# Altium project ina_board_2.PrjPcb
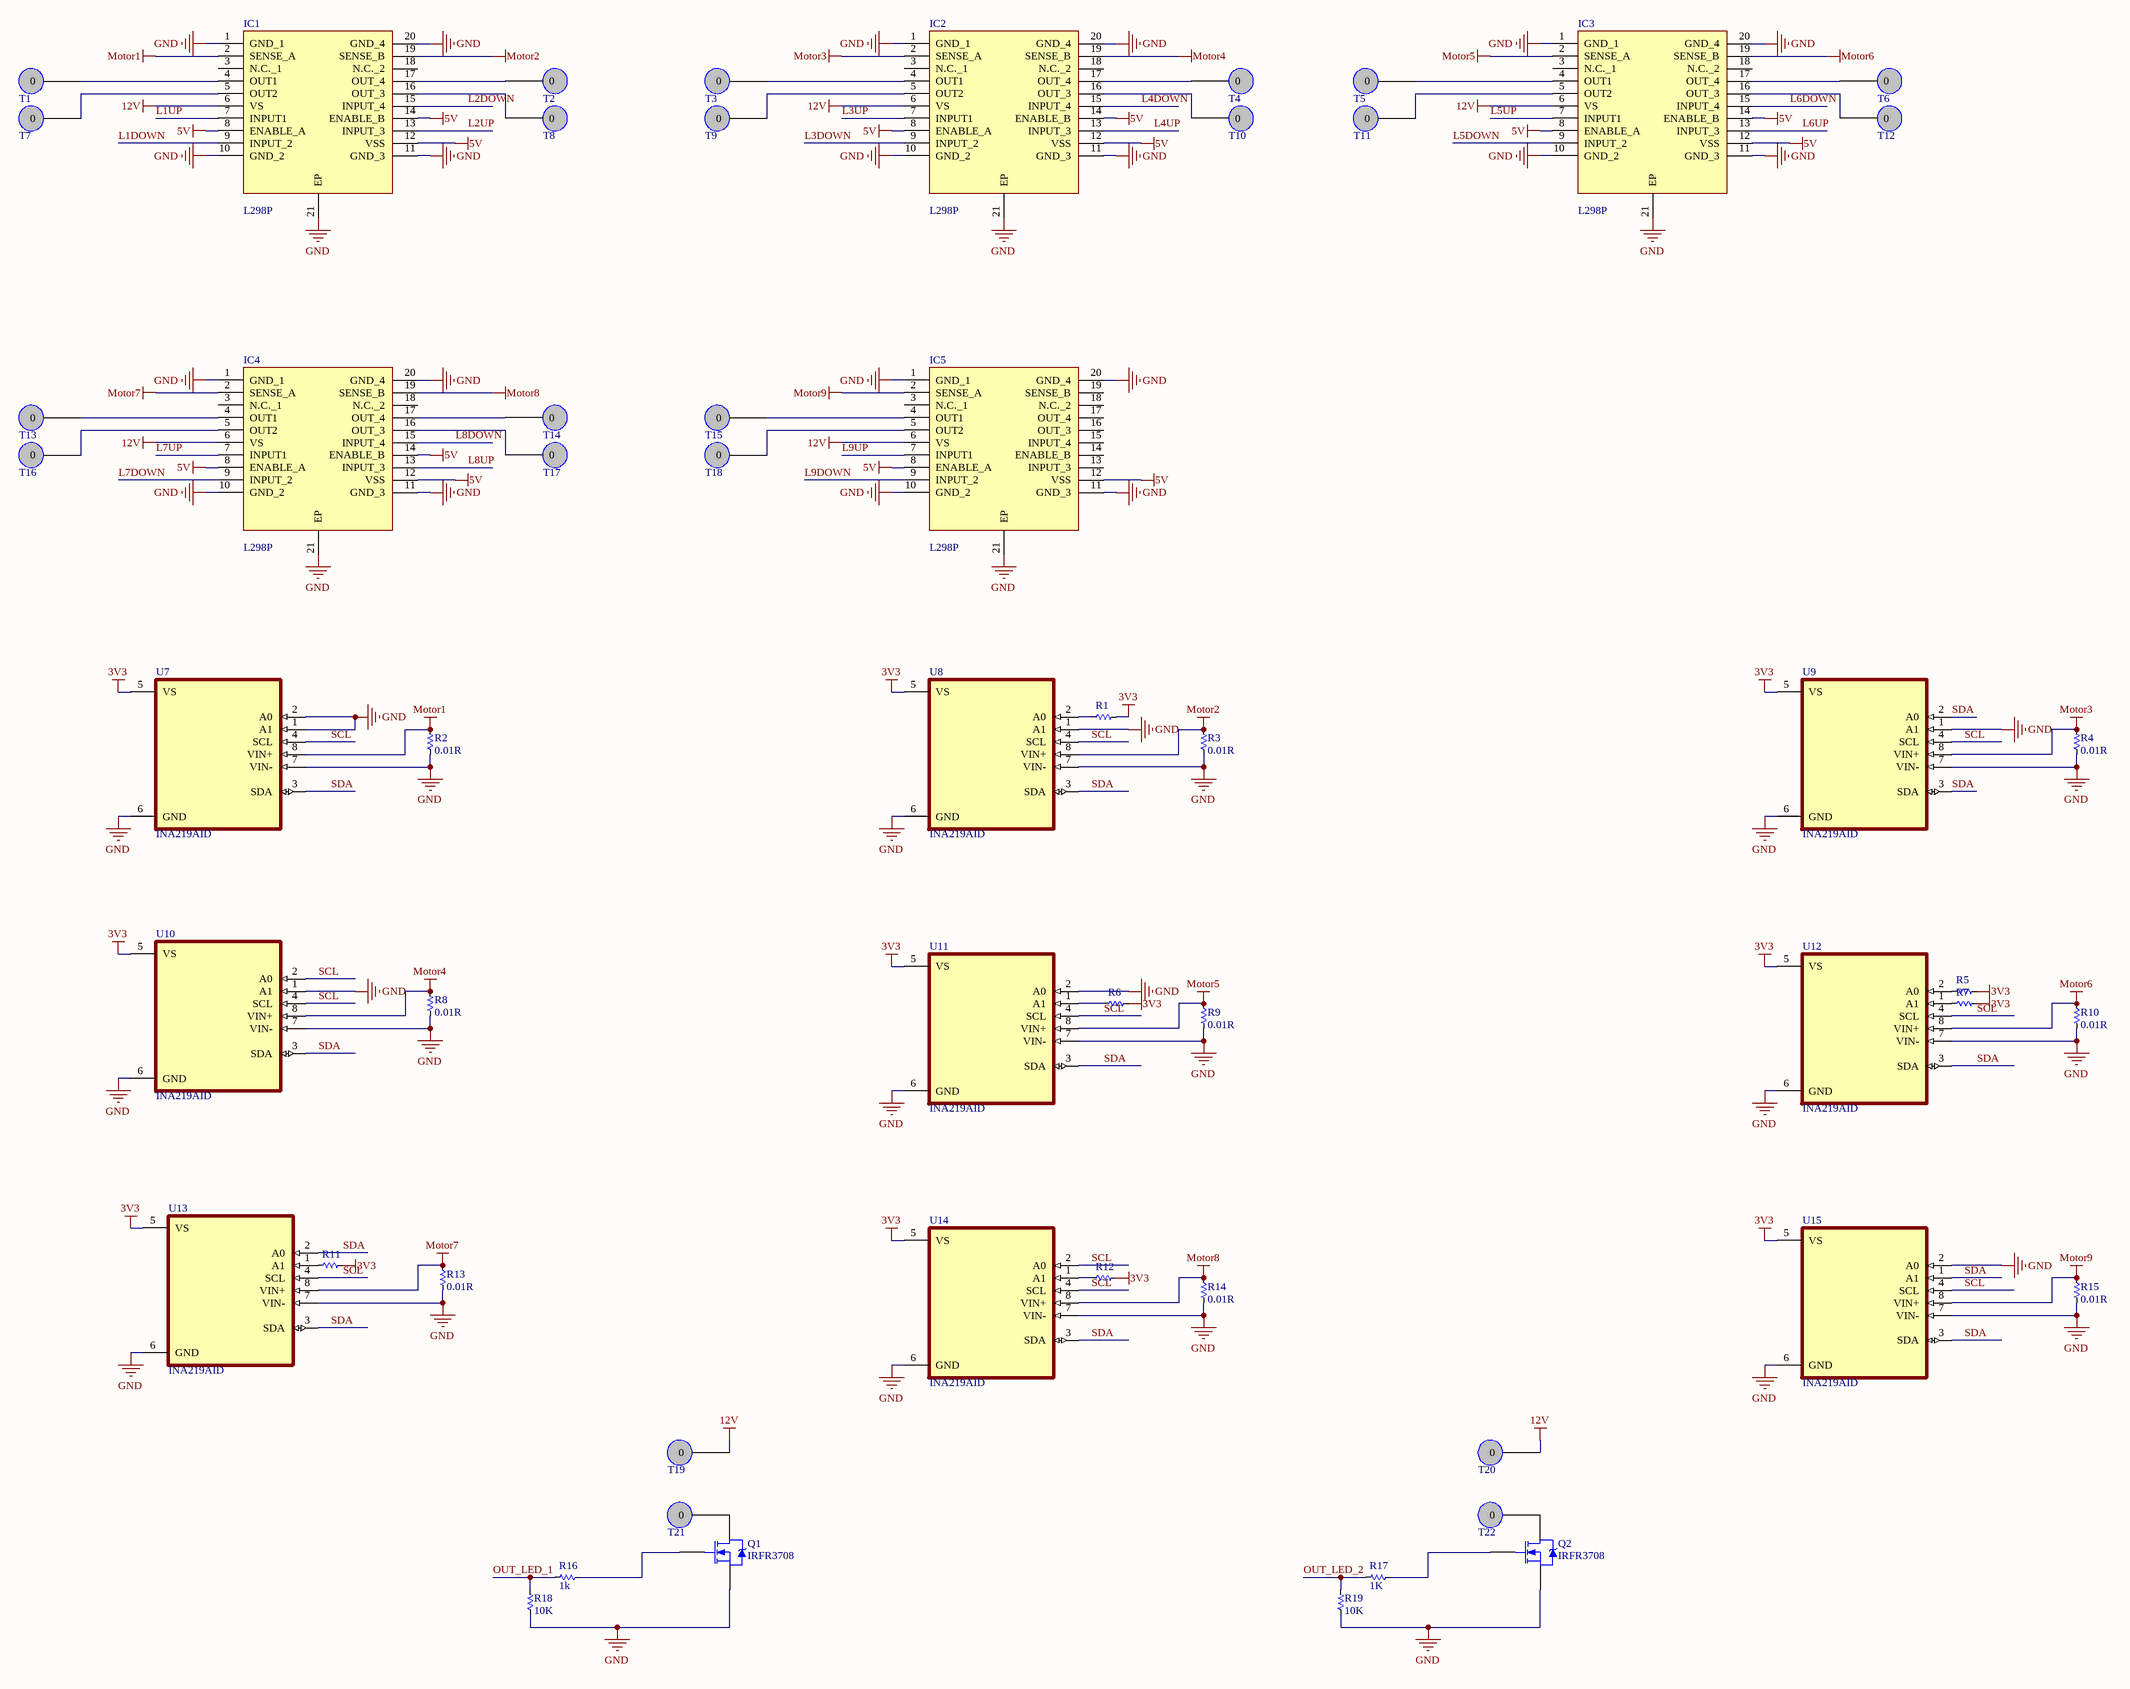
[diagram p0: ina219.SchDoc]
4 sheets, 158 parts. Net scope: global (net labels, ports and power ports of the same name join across sheets).
Board file: board_2.PcbDoc
Sheets:
  ina219.SchDoc
  user.SchDoc
  74hc595.SchDoc
  servo.SchDoc

## Sheet ina219.SchDoc
size A2

### Parts
IC1  L298P  [SOIC127P1420X360-21N]
IC2  L298P  [SOIC127P1420X360-21N]
IC3  L298P  [SOIC127P1420X360-21N]
IC4  L298P  [SOIC127P1420X360-21N]
IC5  L298P  [SOIC127P1420X360-21N]
Q1  IRFR3708  [TO-252AA_M]
Q2  IRFR3708  [TO-252AA_M]
R1  Res  [RES-SMD-0603]  (value not drawn)
R2  0.01R  [RES-SMD-2512]
R3  0.01R  [RES-SMD-2512]
R4  0.01R  [RES-SMD-2512]
R5  Res  [RES-SMD-0603]  (value not drawn)
R6  Res  [RES-SMD-0603]  (value not drawn)
R7  Res  [RES-SMD-0603]  (value not drawn)
R8  0.01R  [RES-SMD-2512]
R9  0.01R  [RES-SMD-2512]
R10  0.01R  [RES-SMD-2512]
R11  Res  [RES-SMD-0603]  (value not drawn)
R12  Res  [RES-SMD-0603]  (value not drawn)
R13  0.01R  [RES-SMD-2512]
R14  0.01R  [RES-SMD-2512]
R15  0.01R  [RES-SMD-2512]
R16  1k  [RES-SMD-0603]
R17  1K  [RES-SMD-0603]
R18  10K  [RES-SMD-0603]
R19  10K  [RES-SMD-0603]
T1  Pad  [PCBComponent_1]  (value not drawn)
T2  Pad  [PCBComponent_1]  (value not drawn)
T3  Pad  [PCBComponent_1]  (value not drawn)
T4  Pad  [PCBComponent_1]  (value not drawn)
T5  Pad  [PCBComponent_1]  (value not drawn)
T6  Pad  [PCBComponent_1]  (value not drawn)
T7  Pad  [PCBComponent_1]  (value not drawn)
T8  Pad  [PCBComponent_1]  (value not drawn)
T9  Pad  [PCBComponent_1]  (value not drawn)
T10  Pad  [PCBComponent_1]  (value not drawn)
T11  Pad  [PCBComponent_1]  (value not drawn)
T12  Pad  [PCBComponent_1]  (value not drawn)
T13  Pad  [PCBComponent_1]  (value not drawn)
T14  Pad  [PCBComponent_1]  (value not drawn)
T15  Pad  [PCBComponent_1]  (value not drawn)
T16  Pad  [PCBComponent_1]  (value not drawn)
T17  Pad  [PCBComponent_1]  (value not drawn)
T18  Pad  [PCBComponent_1]  (value not drawn)
T19  Pad  [PCBComponent_1]  (value not drawn)
T20  Pad  [PCBComponent_1]  (value not drawn)
T21  Pad  [PCBComponent_1]  (value not drawn)
T22  Pad  [PCBComponent_1]  (value not drawn)
U7  INA219AID  [SOIC127P599X175-8N]
U8  INA219AID  [SOIC127P599X175-8N]
U9  INA219AID  [SOIC127P599X175-8N]
U10  INA219AID  [SOIC127P599X175-8N]
U11  INA219AID  [SOIC127P599X175-8N]
U12  INA219AID  [SOIC127P599X175-8N]
U13  INA219AID  [SOIC127P599X175-8N]
U14  INA219AID  [SOIC127P599X175-8N]
U15  INA219AID  [SOIC127P599X175-8N]

### Nets
3V3: R1.1 R5.1 R6.1 R7.1 R11.1 R12.1 U7.5(VS) U8.5(VS) U9.5(VS) U10.5(VS) U11.5(VS) U12.5(VS) U13.5(VS) U14.5(VS) U15.5(VS)
5V: IC1.8(ENABLE_A) IC1.12(VSS) IC1.14(ENABLE_B) IC2.8(ENABLE_A) IC2.12(VSS) IC2.14(ENABLE_B) IC3.8(ENABLE_A) IC3.12(VSS) IC3.14(ENABLE_B) IC4.8(ENABLE_A) IC4.12(VSS) IC4.14(ENABLE_B) IC5.8(ENABLE_A) IC5.12(VSS)
12V: IC1.6(VS) IC2.6(VS) IC3.6(VS) IC4.6(VS) IC5.6(VS) T19.0 T20.0
GND: IC1.1(GND_1) IC1.10(GND_2) IC1.11(GND_3) IC1.20(GND_4) IC1.21(EP) IC2.1(GND_1) IC2.10(GND_2) IC2.11(GND_3) IC2.20(GND_4) IC2.21(EP) IC3.1(GND_1) IC3.10(GND_2) IC3.11(GND_3) IC3.20(GND_4) IC3.21(EP) IC4.1(GND_1) IC4.10(GND_2) IC4.11(GND_3) IC4.20(GND_4) IC4.21(EP) IC5.1(GND_1) IC5.10(GND_2) IC5.11(GND_3) IC5.20(GND_4) IC5.21(EP) Q1.3(S) Q2.3(S) R2.2 R3.2 R4.2 R8.2 R9.2 R10.2 R13.2 R14.2 R15.2 R18.2 R19.2 U7.1(A1) U7.2(A0) U7.6(GND) U7.7(VIN-) U8.1(A1) U8.6(GND) U8.7(VIN-) U9.1(A1) U9.6(GND) U9.7(VIN-) U10.1(A1) U10.6(GND) U10.7(VIN-) U11.2(A0) U11.6(GND) U11.7(VIN-) U12.6(GND) U12.7(VIN-) U13.6(GND) U13.7(VIN-) U14.6(GND) U14.7(VIN-) U15.2(A0) U15.6(GND) U15.7(VIN-)
Motor1: IC1.2(SENSE_A) R2.1 U7.8(VIN+)
Motor2: IC1.19(SENSE_B) R3.1 U8.8(VIN+)
Motor3: IC2.2(SENSE_A) R4.1 U9.8(VIN+)
Motor4: IC2.19(SENSE_B) R8.1 U10.8(VIN+)
Motor5: IC3.2(SENSE_A) R9.1 U11.8(VIN+)
Motor6: IC3.19(SENSE_B) R10.1 U12.8(VIN+)
Motor7: IC4.2(SENSE_A) R13.1 U13.8(VIN+)
Motor8: IC4.19(SENSE_B) R14.1 U14.8(VIN+)
Motor9: IC5.2(SENSE_A) R15.1 U15.8(VIN+)
L1DOWN: IC1.9(INPUT_2)
L1UP: IC1.7(INPUT1)
L2DOWN: IC1.15(INPUT_4)
L2UP: IC1.13(INPUT_3)
L3DOWN: IC2.9(INPUT_2)
L3UP: IC2.7(INPUT1)
L4DOWN: IC2.15(INPUT_4)
L4UP: IC2.13(INPUT_3)
L5DOWN: IC3.9(INPUT_2)
L5UP: IC3.7(INPUT1)
L6DOWN: IC3.15(INPUT_4)
L6UP: IC3.13(INPUT_3)
L7DOWN: IC4.9(INPUT_2)
L7UP: IC4.7(INPUT1)
L8DOWN: IC4.15(INPUT_4)
L8UP: IC4.13(INPUT_3)
L9DOWN: IC5.9(INPUT_2)
L9UP: IC5.7(INPUT1)
OUT_LED_1: R16.1 R18.1
OUT_LED_2: R17.1 R19.1
SCL: U7.4(SCL) U8.4(SCL) U9.4(SCL) U10.2(A0) U10.4(SCL) U11.4(SCL) U12.4(SCL) U13.4(SCL) U14.2(A0) U14.4(SCL) U15.4(SCL)
SDA: U7.3(SDA) U8.3(SDA) U9.2(A0) U9.3(SDA) U10.3(SDA) U11.3(SDA) U12.3(SDA) U13.2(A0) U13.3(SDA) U14.3(SDA) U15.1(A1) U15.3(SDA)
NetIC1_4: IC1.4(OUT1) T1.0
NetIC1_5: IC1.5(OUT2) T7.0
NetIC1_16: IC1.16(OUT_3) T8.0
NetIC1_17: IC1.17(OUT_4) T2.0
NetIC2_4: IC2.4(OUT1) T3.0
NetIC2_5: IC2.5(OUT2) T9.0
NetIC2_16: IC2.16(OUT_3) T10.0
NetIC2_17: IC2.17(OUT_4) T4.0
NetIC3_4: IC3.4(OUT1) T5.0
NetIC3_5: IC3.5(OUT2) T11.0
NetIC3_16: IC3.16(OUT_3) T12.0
NetIC3_17: IC3.17(OUT_4) T6.0
NetIC4_4: IC4.4(OUT1) T13.0
NetIC4_5: IC4.5(OUT2) T16.0
NetIC4_16: IC4.16(OUT_3) T17.0
NetIC4_17: IC4.17(OUT_4) T14.0
NetIC5_4: IC5.4(OUT1) T15.0
NetIC5_5: IC5.5(OUT2) T18.0
NetQ1_1: Q1.1(G) R16.2
NetQ1_4: Q1.4(D) T21.0
NetQ2_1: Q2.1(G) R17.2
NetQ2_4: Q2.4(D) T22.0
NetR1_2: R1.2 U8.2(A0)
NetR5_2: R5.2 U12.2(A0)
NetR6_2: R6.2 U11.1(A1)
NetR7_2: R7.2 U12.1(A1)
NetR11_2: R11.2 U13.1(A1)
NetR12_2: R12.2 U14.1(A1)

Not connected (* = marked no-connect by the designer): IC1 3(N.C._1) 18(N.C._2); IC2 3(N.C._1) 18(N.C._2); IC3 3(N.C._1) 18(N.C._2); IC4 3(N.C._1) 18(N.C._2); IC5 3(N.C._1) 13(INPUT_3) 14(ENABLE_B) 15(INPUT_4) 16(OUT_3) 17(OUT_4) 18(N.C._2) 19(SENSE_B)

### Library data of the parts
IC1-IC5 = L298P: Integrated Circuit; Manufacturer_Name: STMicroelectronics; Datasheet Link: https://datasheet.datasheetarchive.com/originals/distributors/Datasheets-32/DSA-634400.pdf; Height: 3.6mm; Manufacturer_Part_Number: L298P; Mouser Part Number: 511-L298P; Mouser Price/Stock: https://www.mouser.co.uk/ProductDetail/STMicroelectronics/L298P?qs=lDh9v96ogBZNJERYYNX11w%3D%3D; Arrow Part Number: L298P; Arrow Price/Stock: https://www.arrow.com/en/products/l298p/stmicroelectronics
Q1 Q2 = IRFR3910: HEXFET Power MOSFET; Note: Pin 2 is trimmed and is electrically connected to Drain.; Published: 8-Jun-2000; LatestRevisionDate: 20-Nov-2009; LatestRevisionNote: IPC-7351 Footprint Added.; DatasheetVersion: May-1998; PackageVersion: Feb-2003; PackageReference: TO-252AA; Publisher: Altium Limited; PackageDescription: 3-Pin HEXFET Package 2.28 mm Pitch, 9.9 mm Lead Span; Code_JEDEC: TO-252-AA; ComponentLink1Description: Manufacturer Link; ComponentLink1URL: http://www.irf.com/; ComponentLink2Description: Datasheet; ComponentLink2URL: http://www.irf.com/product-info/datasheets/data/irfr3910.pdf
R1-R19 = Res-SMD: Resistor; Manufacturer: Generic Components; Class: Passive; Published: 08/06/2000; Publisher: Altium Hobart Technology Centre
T1-T22 = Component_1
U7-U15 = INA219AID: 26V, 12-bit, i2c output current/voltage/power monitor 8-SOIC -40 to 125; MF: Texas Instruments; Purchase-URL: https://pricing.snapeda.com/search/part/INA219AID/?ref=eda; Package: SOIC-8 Texas Instruments; SnapEDA_Link: https://www.snapeda.com/parts/INA219AID/Texas%20Instruments/view-part/522322/?ref=snap; Value: *; Price: None; MP: INA219AID; Availability: Warning; Check_prices: https://www.snapeda.com/parts/INA219AID/Texas%20Instruments/view-part/522322/?ref=eda

## Sheet user.SchDoc
size A3
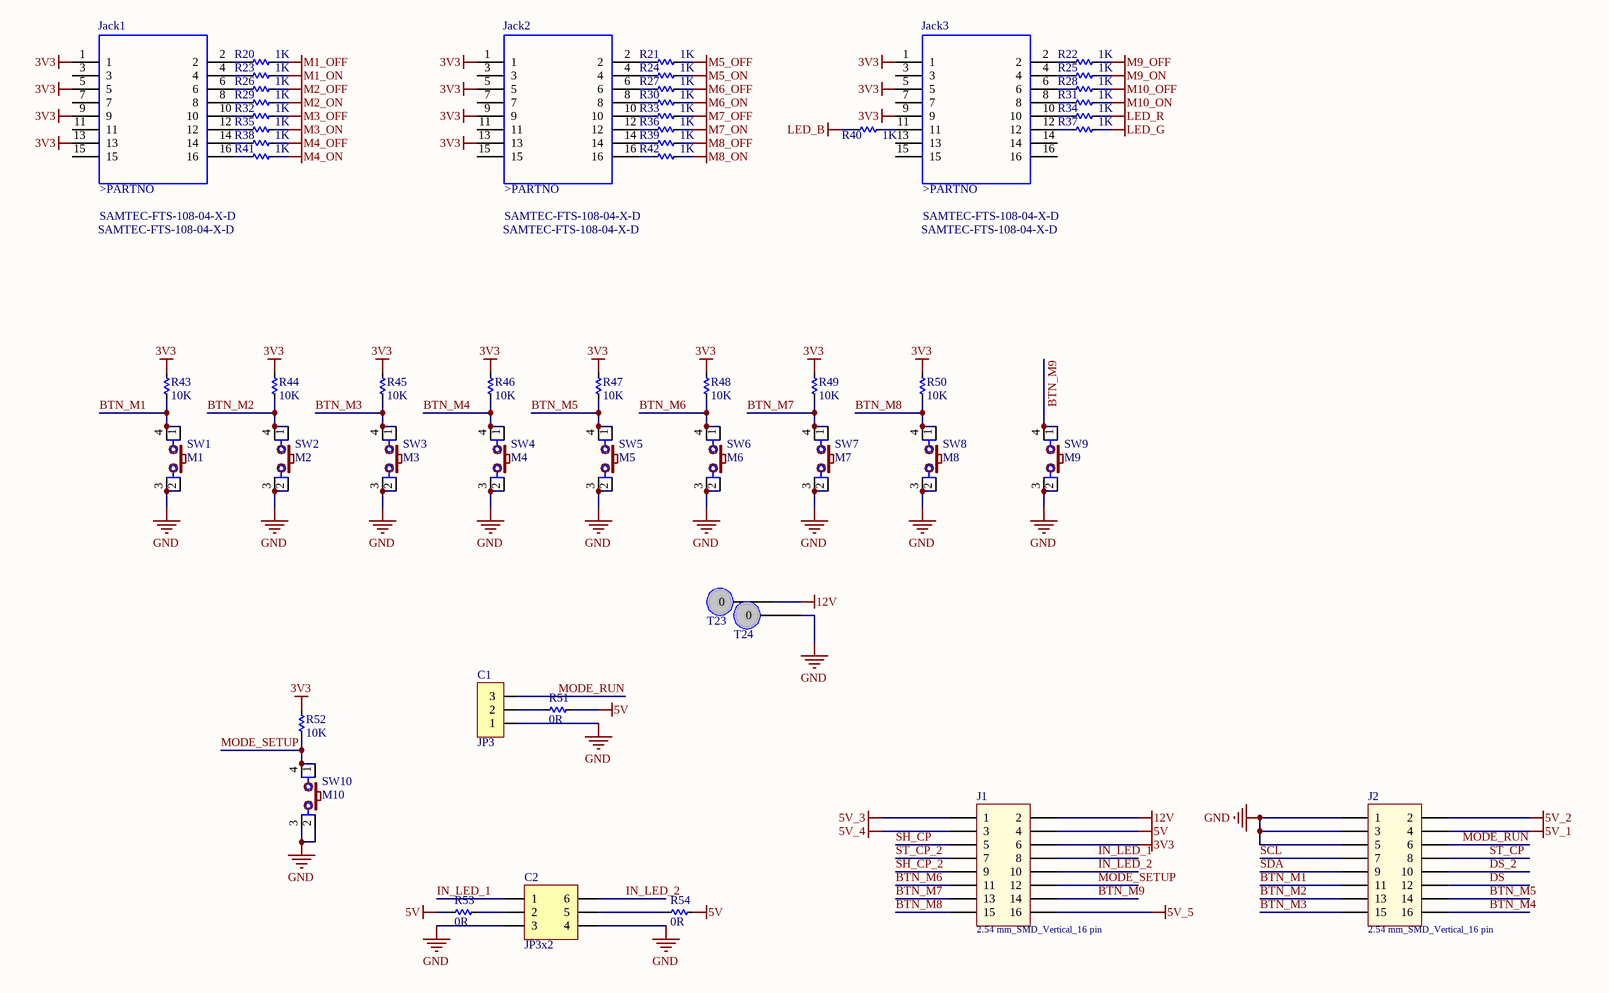
[diagram p1: user.SchDoc]

### Parts
C1  JP3  [JP3-D1C]
C2  JP3x2  [JP3-D2C]
J1  2.54 mm_SMD_Vertical_16 pin  [61031621121]
J2  2.54 mm_SMD_Vertical_16 pin  [61031621121]
Jack1  SAMTEC-FTS-108-04-X-D  [SAMTEC-FTS-108-04-X-D]
Jack2  SAMTEC-FTS-108-04-X-D  [SAMTEC-FTS-108-04-X-D]
Jack3  SAMTEC-FTS-108-04-X-D  [SAMTEC-FTS-108-04-X-D]
R20  1K  [RES-SMD-0603]
R21  1K  [RES-SMD-0603]
R22  1K  [RES-SMD-0603]
R23  1K  [RES-SMD-0603]
R24  1K  [RES-SMD-0603]
R25  1K  [RES-SMD-0603]
R26  1K  [RES-SMD-0603]
R27  1K  [RES-SMD-0603]
R28  1K  [RES-SMD-0603]
R29  1K  [RES-SMD-0603]
R30  1K  [RES-SMD-0603]
R31  1K  [RES-SMD-0603]
R32  1K  [RES-SMD-0603]
R33  1K  [RES-SMD-0603]
R34  1K  [RES-SMD-0603]
R35  1K  [RES-SMD-0603]
R36  1K  [RES-SMD-0603]
R37  1K  [RES-SMD-0603]
R38  1K  [RES-SMD-0603]
R39  1K  [RES-SMD-0603]
R40  1K  [RES-SMD-0603]
R41  1K  [RES-SMD-0603]
R42  1K  [RES-SMD-0603]
R43  10K  [RES-SMD-0603]
R44  10K  [RES-SMD-0603]
R45  10K  [RES-SMD-0603]
R46  10K  [RES-SMD-0603]
R47  10K  [RES-SMD-0603]
R48  10K  [RES-SMD-0603]
R49  10K  [RES-SMD-0603]
R50  10K  [RES-SMD-0603]
R51  0R  [RES-SMD-0603]
R52  10K  [RES-SMD-0603]
R53  0R  [RES-SMD-0603]
R54  0R  [RES-SMD-0603]
SW1  M1  [SW2-SMD]
SW2  M2  [SW2-SMD]
SW3  M3  [SW2-SMD]
SW4  M4  [SW2-SMD]
SW5  M5  [SW2-SMD]
SW6  M6  [SW2-SMD]
SW7  M7  [SW2-SMD]
SW8  M8  [SW2-SMD]
SW9  M9  [SW2-SMD]
SW10  M10  [SW2-SMD]
T23  Pad  [PCBComponent_1]  (value not drawn)
T24  Pad  [PCBComponent_1]  (value not drawn)

### Nets
3V3: J1.6 Jack1.1 Jack1.5 Jack1.9 Jack1.13 Jack2.1 Jack2.5 Jack2.9 Jack2.13 Jack3.1 Jack3.5 Jack3.9 R43.1 R44.1 R45.1 R46.1 R47.1 R48.1 R49.1 R50.1 R52.1
5V: J1.4 R51.1 R53.2 R54.1
5V_1: J2.4
5V_2: J2.2
5V_3: J1.1
5V_4: J1.3
5V_5: J1.16
12V: J1.2 T23.0
GND: C1.1 C2.3 C2.4 J2.1 J2.3 J2.5 SW1.2 SW1.3 SW2.2 SW2.3 SW3.2 SW3.3 SW4.2 SW4.3 SW5.2 SW5.3 SW6.2 SW6.3 SW7.2 SW7.3 SW8.2 SW8.3 SW9.2 SW9.3 SW10.2 SW10.3 T24.0
LED_B: R40.2
LED_G: R37.2
LED_R: R34.2
M1_OFF: R20.2
M1_ON: R23.2
M2_OFF: R26.2
M2_ON: R29.2
M3_OFF: R32.2
M3_ON: R35.2
M4_OFF: R38.2
M4_ON: R41.2
M5_OFF: R21.2
M5_ON: R24.2
M6_OFF: R27.2
M6_ON: R30.2
M7_OFF: R33.2
M7_ON: R36.2
M8_OFF: R39.2
M8_ON: R42.2
M9_OFF: R22.2
M9_ON: R25.2
M10_OFF: R28.2
M10_ON: R31.2
BTN_M1: J2.11 R43.2 SW1.1 SW1.4
BTN_M2: J2.13 R44.2 SW2.1 SW2.4
BTN_M3: J2.15 R45.2 SW3.1 SW3.4
BTN_M4: J2.16 R46.2 SW4.1 SW4.4
BTN_M5: J2.14 R47.2 SW5.1 SW5.4
BTN_M6: J1.11 R48.2 SW6.1 SW6.4
BTN_M7: J1.13 R49.2 SW7.1 SW7.4
BTN_M8: J1.15 R50.2 SW8.1 SW8.4
BTN_M9: J1.14 SW9.1 SW9.4
DS: J2.12
DS_2: J2.10
IN_LED_1: C2.1 J1.8
IN_LED_2: C2.6 J1.10
MODE_RUN: C1.3 J2.6
MODE_SETUP: J1.12 R52.2 SW10.1 SW10.4
SCL: J2.7
SDA: J2.9
SH_CP: J1.5
SH_CP_2: J1.9
ST_CP: J2.8
ST_CP_2: J1.7
NetC1_2: C1.2 R51.2
NetC2_2: C2.2 R53.1
NetC2_5: C2.5 R54.2
NetJack1_2: Jack1.2 R20.1
NetJack1_4: Jack1.4 R23.1
NetJack1_6: Jack1.6 R26.1
NetJack1_8: Jack1.8 R29.1
NetJack1_10: Jack1.10 R32.1
NetJack1_12: Jack1.12 R35.1
NetJack1_14: Jack1.14 R38.1
NetJack1_16: Jack1.16 R41.1
NetJack2_2: Jack2.2 R21.1
NetJack2_4: Jack2.4 R24.1
NetJack2_6: Jack2.6 R27.1
NetJack2_8: Jack2.8 R30.1
NetJack2_10: Jack2.10 R33.1
NetJack2_12: Jack2.12 R36.1
NetJack2_14: Jack2.14 R39.1
NetJack2_16: Jack2.16 R42.1
NetJack3_2: Jack3.2 R22.1
NetJack3_4: Jack3.4 R25.1
NetJack3_6: Jack3.6 R28.1
NetJack3_8: Jack3.8 R31.1
NetJack3_10: Jack3.10 R34.1
NetJack3_11: Jack3.11 R40.1
NetJack3_12: Jack3.12 R37.1

Not connected (* = marked no-connect by the designer): Jack1 3 7 11 15; Jack2 3 7 11 15; Jack3 3 7 13 14 15 16

### Notes on the sheet
- (in symbol SAMTEC-FTS-108-04-X-D) >PARTNO

### Library data of the parts
C1 = JP3: WR-PHD 2.54 mm Angled Socket Header; Manufacturer: W¨¹rth Elektronik eiSos GmbH; partNo: 613003143121; ComponentLink1 Description: Manufacturer; ComponentLink2 Description: Datasheet; NoPins: 03; Created Date: 29 March 2013; ComponentLink1URL: http://www.we-online.com; ComponentLink2URL: http://katalog.we-online.de/em/datasheet/6130xx143121.pdf; Created by: Karrer Zheng
C2 = JP3x2: WR-PHD 2.54 mm Dual Socket Header; Manufacturer: W¨¹rth Elektronik eiSos GmbH; partNo: 61300621821; ComponentLink1 Description: Manufacturer; ComponentLink2 Description: Datasheet; NoPins: 06; Created Date: 29 March 2013; ComponentLink1URL: http://www.we-online.com; ComponentLink2URL: http://katalog.we-online.de/em/datasheet/6130xx21821.pdf; Created by: Karrer Zheng
J1 J2 = 61031621121: Pin Header WR-PHD, pitch 2.54 mm, SMD, Vertical, dual row, 16 pin; Rated Current: 3 A; Pin Number: 16; Pitch: 2.54 mm; Working Voltage: 250 VAC; Contact Resistance: 20 mOhm; Insulation Resistance: >1000 MOhm; ComponentLink1Description: Manufacturer; ComponentLink1URL: http://www.we-online.de; ComponentLink2Description: Datasheet; ComponentLink2URL: http://katalog.we-online.de/em/datasheet/6103xx21121.pdf; Part Number: 61031621121; Published Date: Jan. 2018; Publisher: Wurth Elektronik; Operating Temperature: -40 to 125 degC; Mounting Technology: SMD; Row Number: Dual; Orientation: Vertical
R20-R54 = Res-SMD: as R1 on sheet ina219; Published: 08/06/2000; Publisher: Altium Hobart Technology Centre
SW1-SW10 = SW4: Switch button 4 pin; Value: Button chip 4 pin
T23 T24 = Component_1
Jack1-Jack3 = SAMTEC-FTS-108-04-X-D: Package: None; Price: None; Value: *; MP: SAMTEC-FTS-108-04-X-D; Availability: Unavailable

## Sheet 74hc595.SchDoc
size A3
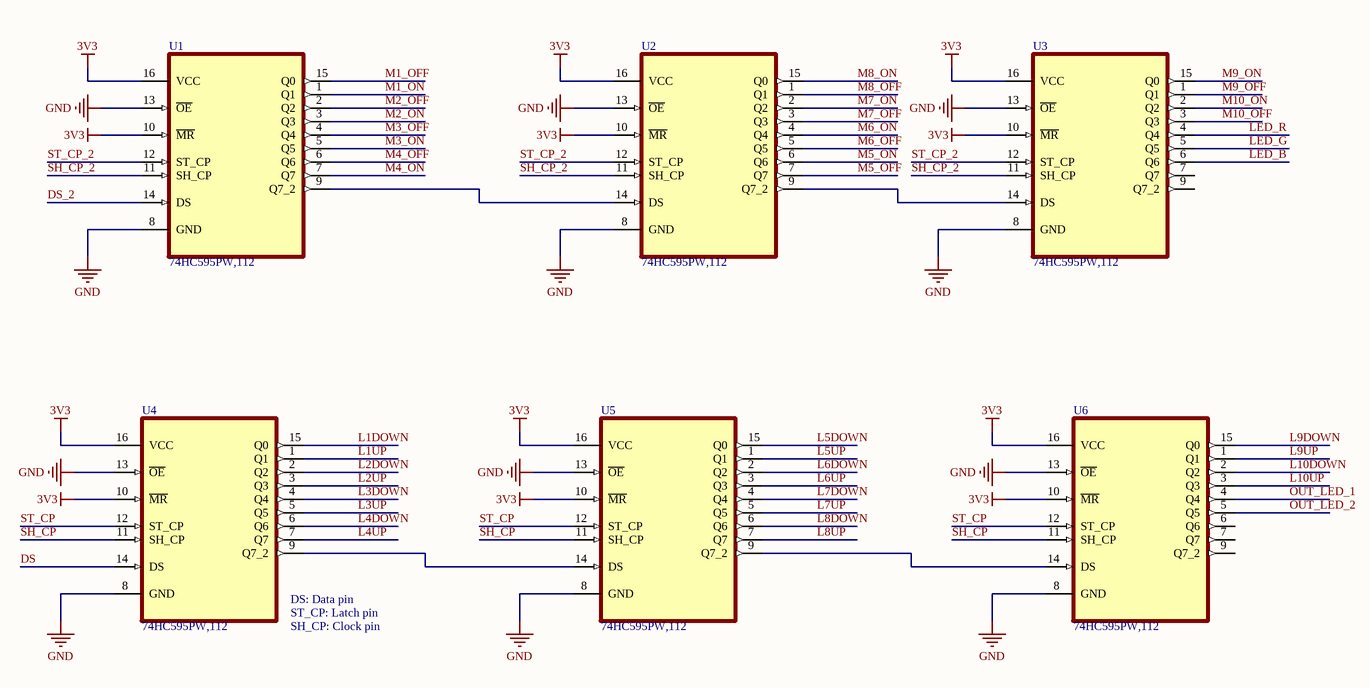
[diagram p2: 74hc595.SchDoc]

### Parts
U1  74HC595PW,112  [SOP65P640X110-16N]
U2  74HC595PW,112  [SOP65P640X110-16N]
U3  74HC595PW,112  [SOP65P640X110-16N]
U4  74HC595PW,112  [SOP65P640X110-16N]
U5  74HC595PW,112  [SOP65P640X110-16N]
U6  74HC595PW,112  [SOP65P640X110-16N]

### Nets
3V3: U1.10(~{MR}) U1.16(VCC) U2.10(~{MR}) U2.16(VCC) U3.10(~{MR}) U3.16(VCC) U4.10(~{MR}) U4.16(VCC) U5.10(~{MR}) U5.16(VCC) U6.10(~{MR}) U6.16(VCC)
GND: U1.8(GND) U1.13(~{OE}) U2.8(GND) U2.13(~{OE}) U3.8(GND) U3.13(~{OE}) U4.8(GND) U4.13(~{OE}) U5.8(GND) U5.13(~{OE}) U6.8(GND) U6.13(~{OE})
LED_B: U3.6(Q6)
LED_G: U3.5(Q5)
LED_R: U3.4(Q4)
M1_OFF: U1.15(Q0)
M1_ON: U1.1(Q1)
M2_OFF: U1.2(Q2)
M2_ON: U1.3(Q3)
M3_OFF: U1.4(Q4)
M3_ON: U1.5(Q5)
M4_OFF: U1.6(Q6)
M4_ON: U1.7(Q7)
M5_OFF: U2.7(Q7)
M5_ON: U2.6(Q6)
M6_OFF: U2.5(Q5)
M6_ON: U2.4(Q4)
M7_OFF: U2.3(Q3)
M7_ON: U2.2(Q2)
M8_OFF: U2.1(Q1)
M8_ON: U2.15(Q0)
M9_OFF: U3.1(Q1)
M9_ON: U3.15(Q0)
M10_OFF: U3.3(Q3)
M10_ON: U3.2(Q2)
DS: U4.14(DS)
DS_2: U1.14(DS)
L1DOWN: U4.15(Q0)
L1UP: U4.1(Q1)
L2DOWN: U4.2(Q2)
L2UP: U4.3(Q3)
L3DOWN: U4.4(Q4)
L3UP: U4.5(Q5)
L4DOWN: U4.6(Q6)
L4UP: U4.7(Q7)
L5DOWN: U5.15(Q0)
L5UP: U5.1(Q1)
L6DOWN: U5.2(Q2)
L6UP: U5.3(Q3)
L7DOWN: U5.4(Q4)
L7UP: U5.5(Q5)
L8DOWN: U5.6(Q6)
L8UP: U5.7(Q7)
L9DOWN: U6.15(Q0)
L9UP: U6.1(Q1)
L10DOWN: U6.2(Q2)
L10UP: U6.3(Q3)
OUT_LED_1: U6.4(Q4)
OUT_LED_2: U6.5(Q5)
SH_CP: U4.11(SH_CP) U5.11(SH_CP) U6.11(SH_CP)
SH_CP_2: U1.11(SH_CP) U2.11(SH_CP) U3.11(SH_CP)
ST_CP: U4.12(ST_CP) U5.12(ST_CP) U6.12(ST_CP)
ST_CP_2: U1.12(ST_CP) U2.12(ST_CP) U3.12(ST_CP)
NetU1_9: U1.9(Q7_2) U2.14(DS)
NetU2_9: U2.9(Q7_2) U3.14(DS)
NetU4_9: U4.9(Q7_2) U5.14(DS)
NetU5_9: U5.9(Q7_2) U6.14(DS)

Not connected (* = marked no-connect by the designer): U3 7(Q7) 9(Q7_2); U6 6(Q6) 7(Q7) 9(Q7_2)

### Notes on the sheet
- (near U4) DS: Data pin
- (near U4) ST_CP: Latch pin
- (near U4) SH_CP: Clock pin

### Library data of the parts
U1-U6 = 74HC595PW,112: Shift Shift Register 1 Element 8 Bit 16-TSSOP; MF: Nexperia; Value: *; Mouser-Purchase-URL: https://snapeda.com/shop?store=Mouser&id=43267; Package: TSSOP-16 NXP Semiconductors; DigiKey-Purchase-URL: https://snapeda.com/shop?store=DigiKey&id=43267; Price: None; MP: 74HC595PW,112; Availability: Unavailable; SnapEDA_Link: https://www.snapeda.com/parts/74HC595PW,112/Nexperia/view-part/43267/?ref=snap

## Sheet servo.SchDoc
size A
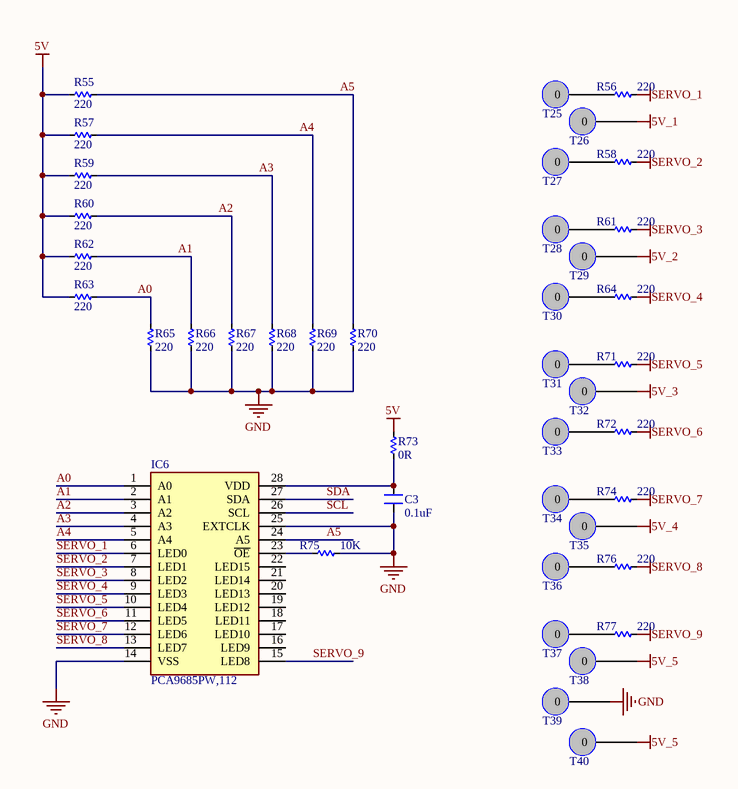
[diagram p3: servo.SchDoc]

### Parts
C3  0.1uF  [CN-SMD-0603]
IC6  PCA9685PW,112  [SOP65P640X110-28N]
R55  220  [RES-SMD-0603]
R56  220  [RES-SMD-0603]
R57  220  [RES-SMD-0603]
R58  220  [RES-SMD-0603]
R59  220  [RES-SMD-0603]
R60  220  [RES-SMD-0603]
R61  220  [RES-SMD-0603]
R62  220  [RES-SMD-0603]
R63  220  [RES-SMD-0603]
R64  220  [RES-SMD-0603]
R65  220  [RES-SMD-0603]
R66  220  [RES-SMD-0603]
R67  220  [RES-SMD-0603]
R68  220  [RES-SMD-0603]
R69  220  [RES-SMD-0603]
R70  220  [RES-SMD-0603]
R71  220  [RES-SMD-0603]
R72  220  [RES-SMD-0603]
R73  0R  [RES-SMD-0603]
R74  220  [RES-SMD-0603]
R75  10K  [RES-SMD-0603]
R76  220  [RES-SMD-0603]
R77  220  [RES-SMD-0603]
T25  Pad  [PCBComponent_1]  (value not drawn)
T26  Pad  [PCBComponent_1]  (value not drawn)
T27  Pad  [PCBComponent_1]  (value not drawn)
T28  Pad  [PCBComponent_1]  (value not drawn)
T29  Pad  [PCBComponent_1]  (value not drawn)
T30  Pad  [PCBComponent_1]  (value not drawn)
T31  Pad  [PCBComponent_1]  (value not drawn)
T32  Pad  [PCBComponent_1]  (value not drawn)
T33  Pad  [PCBComponent_1]  (value not drawn)
T34  Pad  [PCBComponent_1]  (value not drawn)
T35  Pad  [PCBComponent_1]  (value not drawn)
T36  Pad  [PCBComponent_1]  (value not drawn)
T37  Pad  [PCBComponent_1]  (value not drawn)
T38  Pad  [PCBComponent_1]  (value not drawn)
T39  Pad  [PCBComponent_1]  (value not drawn)
T40  Pad  [PCBComponent_1]  (value not drawn)

### Nets
5V: R55.2 R57.2 R59.2 R60.2 R62.2 R63.2 R73.1
5V_1: T26.0
5V_2: T29.0
5V_3: T32.0
5V_4: T35.0
5V_5: T38.0 T40.0
GND: C3.1 IC6.14(VSS) IC6.25(EXTCLK) R65.2 R66.2 R67.2 R68.2 R69.2 R70.2 R75.2 T39.0
SERVO_1: IC6.6(LED0) R56.1
SERVO_2: IC6.7(LED1) R58.1
SERVO_3: IC6.8(LED2) R61.1
SERVO_4: IC6.9(LED3) R64.1
SERVO_5: IC6.10(LED4) R71.1
SERVO_6: IC6.11(LED5) R72.1
SERVO_7: IC6.12(LED6) R74.1
SERVO_8: IC6.13(LED7) R76.1
SERVO_9: IC6.15(LED8) R77.1
A0: IC6.1(A0) R63.1 R65.1
A1: IC6.2(A1) R62.1 R66.1
A2: IC6.3(A2) R60.1 R67.1
A3: IC6.4(A3) R59.1 R68.1
A4: IC6.5(A4) R57.1 R69.1
A5: IC6.24(A5) R55.1 R70.1
SCL: IC6.26(SCL)
SDA: IC6.27(SDA)
NetC3_2: C3.2 IC6.28(VDD) R73.2
NetIC6_23: IC6.23(~{OE}) R75.1
NetR56_2: R56.2 T25.0
NetR58_2: R58.2 T27.0
NetR61_2: R61.2 T28.0
NetR64_2: R64.2 T30.0
NetR71_2: R71.2 T31.0
NetR72_2: R72.2 T33.0
NetR74_2: R74.2 T34.0
NetR76_2: R76.2 T36.0
NetR77_2: R77.2 T37.0

Not connected (* = marked no-connect by the designer): IC6 16(LED9) 17(LED10) 18(LED11) 19(LED12) 20(LED13) 21(LED14) 22(LED15)

### Library data of the parts
C3 = CN: Tu gom; Value: 33pF
IC6 = PCA9685PW,112: Integrated Circuit; Manufacturer_Name: NXP; Datasheet Link: http://www.nxp.com/docs/en/data-sheet/PCA9685.pdf; Height: 1.1mm; Manufacturer_Part_Number: PCA9685PW,112; Mouser Part Number: 771-PCA9685PW,112; Mouser Price/Stock: https://www.mouser.co.uk/ProductDetail/NXP-Semiconductors/PCA9685PW112?qs=6YAT8rHPFU9wZqiAeiOMZw%3D%3D; Arrow Part Number: PCA9685PW,112; Arrow Price/Stock: https://www.arrow.com/en/products/pca9685pw112/nxp-semiconductors?region=nac
R55-R77 = Res-SMD: as R1 on sheet ina219; Published: 08/06/2000; Publisher: Altium Hobart Technology Centre
T25-T40 = Component_1

## Nets that join several sheets
3V3: ina219 (15 pins), user (21 pins), 74hc595 (12 pins)
5V: ina219 (14 pins), user (J1.4 R51.1 R53.2 R54.1), servo (7 pins)
5V_1: user (J2.4), servo (T26.0)
5V_2: user (J2.2), servo (T29.0)
5V_3: user (J1.1), servo (T32.0)
5V_4: user (J1.3), servo (T35.0)
5V_5: user (J1.16), servo (T38.0 T40.0)
12V: ina219 (7 pins), user (J1.2 T23.0)
GND: ina219 (63 pins), user (27 pins), 74hc595 (12 pins), servo (11 pins)
LED_B: user (R40.2), 74hc595 (U3.6)
LED_G: user (R37.2), 74hc595 (U3.5)
LED_R: user (R34.2), 74hc595 (U3.4)
M1_OFF: user (R20.2), 74hc595 (U1.15)
M1_ON: user (R23.2), 74hc595 (U1.1)
M2_OFF: user (R26.2), 74hc595 (U1.2)
M2_ON: user (R29.2), 74hc595 (U1.3)
M3_OFF: user (R32.2), 74hc595 (U1.4)
M3_ON: user (R35.2), 74hc595 (U1.5)
M4_OFF: user (R38.2), 74hc595 (U1.6)
M4_ON: user (R41.2), 74hc595 (U1.7)
M5_OFF: user (R21.2), 74hc595 (U2.7)
M5_ON: user (R24.2), 74hc595 (U2.6)
M6_OFF: user (R27.2), 74hc595 (U2.5)
M6_ON: user (R30.2), 74hc595 (U2.4)
M7_OFF: user (R33.2), 74hc595 (U2.3)
M7_ON: user (R36.2), 74hc595 (U2.2)
M8_OFF: user (R39.2), 74hc595 (U2.1)
M8_ON: user (R42.2), 74hc595 (U2.15)
M9_OFF: user (R22.2), 74hc595 (U3.1)
M9_ON: user (R25.2), 74hc595 (U3.15)
M10_OFF: user (R28.2), 74hc595 (U3.3)
M10_ON: user (R31.2), 74hc595 (U3.2)
DS: user (J2.12), 74hc595 (U4.14)
DS_2: user (J2.10), 74hc595 (U1.14)
L1DOWN: ina219 (IC1.9), 74hc595 (U4.15)
L1UP: ina219 (IC1.7), 74hc595 (U4.1)
L2DOWN: ina219 (IC1.15), 74hc595 (U4.2)
L2UP: ina219 (IC1.13), 74hc595 (U4.3)
L3DOWN: ina219 (IC2.9), 74hc595 (U4.4)
L3UP: ina219 (IC2.7), 74hc595 (U4.5)
L4DOWN: ina219 (IC2.15), 74hc595 (U4.6)
L4UP: ina219 (IC2.13), 74hc595 (U4.7)
L5DOWN: ina219 (IC3.9), 74hc595 (U5.15)
L5UP: ina219 (IC3.7), 74hc595 (U5.1)
L6DOWN: ina219 (IC3.15), 74hc595 (U5.2)
L6UP: ina219 (IC3.13), 74hc595 (U5.3)
L7DOWN: ina219 (IC4.9), 74hc595 (U5.4)
L7UP: ina219 (IC4.7), 74hc595 (U5.5)
L8DOWN: ina219 (IC4.15), 74hc595 (U5.6)
L8UP: ina219 (IC4.13), 74hc595 (U5.7)
L9DOWN: ina219 (IC5.9), 74hc595 (U6.15)
L9UP: ina219 (IC5.7), 74hc595 (U6.1)
OUT_LED_1: ina219 (R16.1 R18.1), 74hc595 (U6.4)
OUT_LED_2: ina219 (R17.1 R19.1), 74hc595 (U6.5)
SCL: ina219 (11 pins), user (J2.7), servo (IC6.26)
SDA: ina219 (12 pins), user (J2.9), servo (IC6.27)
SH_CP: user (J1.5), 74hc595 (U4.11 U5.11 U6.11)
SH_CP_2: user (J1.9), 74hc595 (U1.11 U2.11 U3.11)
ST_CP: user (J2.8), 74hc595 (U4.12 U5.12 U6.12)
ST_CP_2: user (J1.7), 74hc595 (U1.12 U2.12 U3.12)